# Altium schematic sheet LAUNCHXL-F28379D_3.SchDoc
size 301 x 239 mm
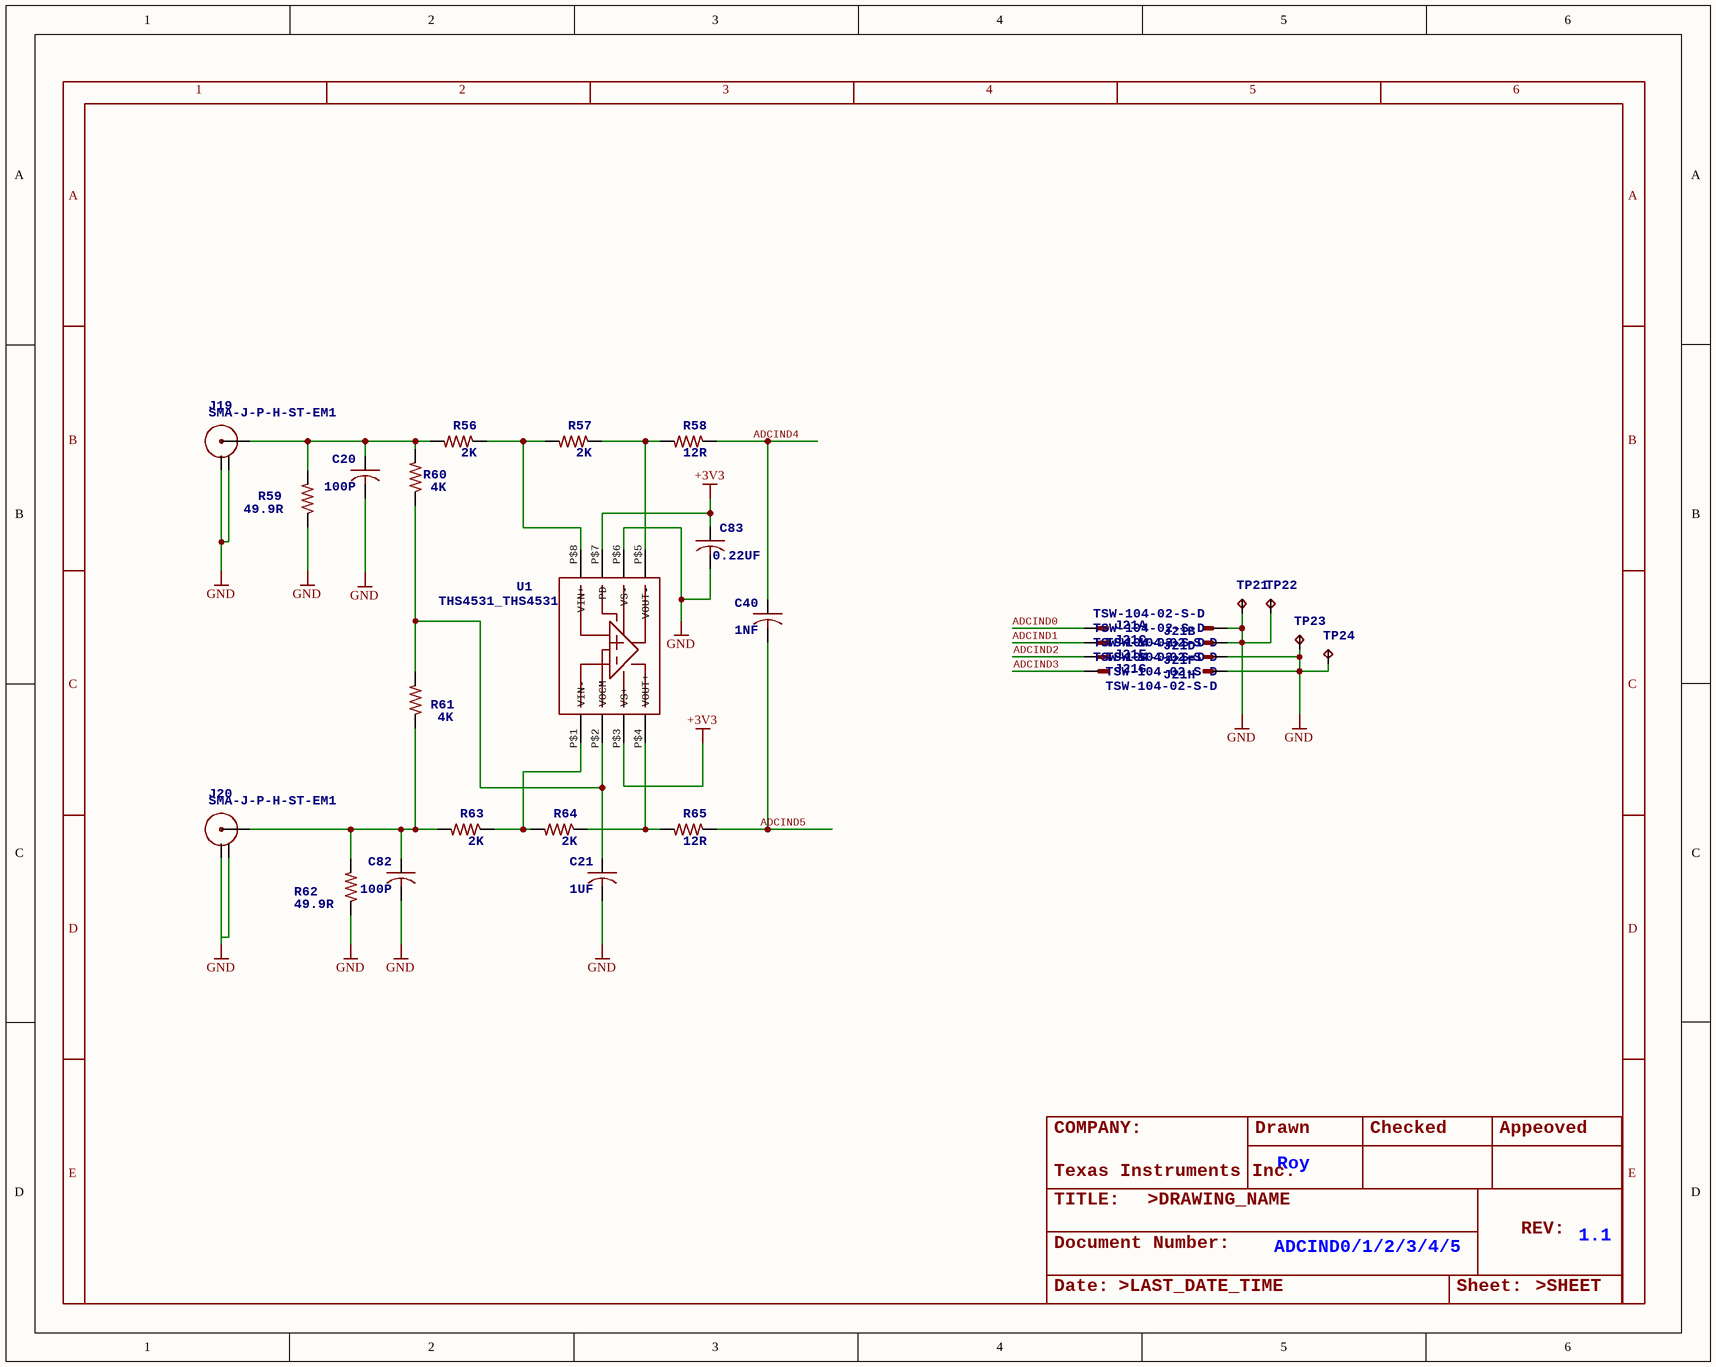
[diagram p0: LAUNCHXL-F28379D_3.SchDoc]

## Parts
C20  100P  [C0402]
C21  1UF  [C0402]
C40  1NF  [C0402]
C82  100P  [C0402]
C83  0.22UF  [C0402]
J19  SMA-J-P-H-ST-EM1  [SMA_EM]
J20  SMA-J-P-H-ST-EM1  [SMA_EM]
J21  TSW-104-02-S-D  [TSW-104-02-S-D]  (parts A,B,C,D,E,F,G,H of 8)
R56  2K  [R0402]
R57  2K  [R0402]
R58  12R  [R0402]
R59  49.9R  [R0402]
R60  4K  [R0402]
R61  4K  [R0402]
R62  49.9R  [R0402]
R63  2K  [R0402]
R64  2K  [R0402]
R65  12R  [R0402]
TP21  TESTPAD_TPB1,27  [TESTPAD_B1,27]  (value not drawn)
TP22  TESTPAD_TPB1,27  [TESTPAD_B1,27]  (value not drawn)
TP23  TESTPAD_TPB1,27  [TESTPAD_B1,27]  (value not drawn)
TP24  TESTPAD_TPB1,27  [TESTPAD_B1,27]  (value not drawn)
U1  THS4531_THS4531  [THS4531_THS4531]

## Nets
+3V3: C83.1 U1.P$3(VS+) U1.P$7(PD)
GND: C20.2 C21.2 C82.2 C83.2 J19.1 J19.3_4_5 J20.1 J20.3_4_5 J21.2 J21.4 J21.6 J21.8 R59.1 R62.1 TP21.TP TP22.TP TP23.TP TP24.TP U1.P$6(VS-)
ADCIND0: J21.1
ADCIND1: J21.3
ADCIND2: J21.5
ADCIND3: J21.7
ADCIND4: C40.1 R58.1
ADCIND5: C40.2 R65.1
NetC20_1: C20.1 J19.2 R56.2 R59.2 R60.2
NetC21_1: C21.1 R60.1 R61.2 U1.P$2(VOCM)
NetC82_1: C82.1 J20.2 R61.1 R62.2 R63.2
NetR56_1: R56.1 R57.2 U1.P$8(VIN+)
NetR57_1: R57.1 R58.2 U1.P$5(VOUT-)
NetR63_1: R63.1 R64.2 U1.P$1(VIN-)
NetR64_1: R64.1 R65.2 U1.P$4(VOUT+)

## Notes on the sheet
- COMPANY:
- Drawn
- Roy
- Checked
- Appeoved
- TITLE:
- Document Number:
- Texas
  Instruments Inc.
- >DRAWING_NAME
- REV:
- 1.1
- Date:
- >LAST_DATE_TIME
- ADCIND0/1/2/3/4/5
- Sheet:
- >SHEET
- 1
- 2
- 3
- 4
- 5
- 6
- A
- B
- C
- D
- E

## Library data of the parts
C20 C21 C40 C82 C83 = C-USC0402: <B>CAPACITOR</B>, American symbol
J19 J20 = SMA
J21 = TSW-104-02-S-D: <b>THROUGH-HOLE .025" SQ POST HEADER</b><p> / Source: Samtec TSW.pdf; OC_FARNELL: unknown; OC_NEWARK: unknown
R56-R65 = R-US_R0402: <B>RESISTOR</B>, American symbol
TP21-TP24 = TESTPAD_TPB1,27: <b>Test pad</b>